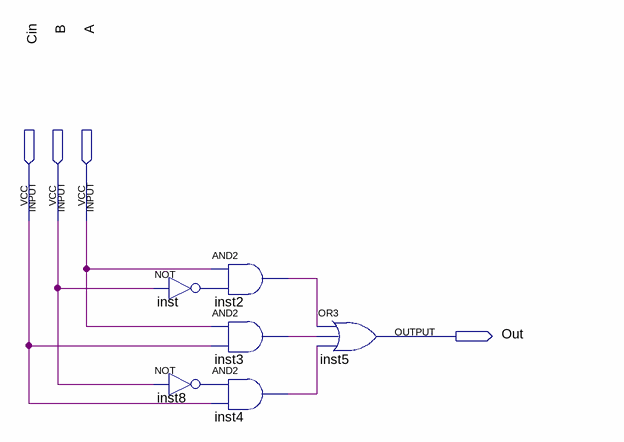
[diagram p0: schematic sheet]
// Quartus schematic maiorque1bit.bdf as structural Verilog: 6 symbols, 4 pins
module maiorque1bit (
  input  Cin,
  input  B,
  input  A,
  output Out
);

  wire inst2_out, inst3_out, inst4_out, inst8_out, inst_out;

  not inst (inst_out, B);
  not inst8 (inst8_out, B);
  and inst2 (inst2_out, A, inst_out);
  and inst3 (inst3_out, A, Cin);
  and inst4 (inst4_out, inst8_out, Cin);
  or inst5 (Out, inst2_out, inst3_out, inst4_out);
endmodule
